# Altium schematic sheet GL852-0.SchDoc
size A4
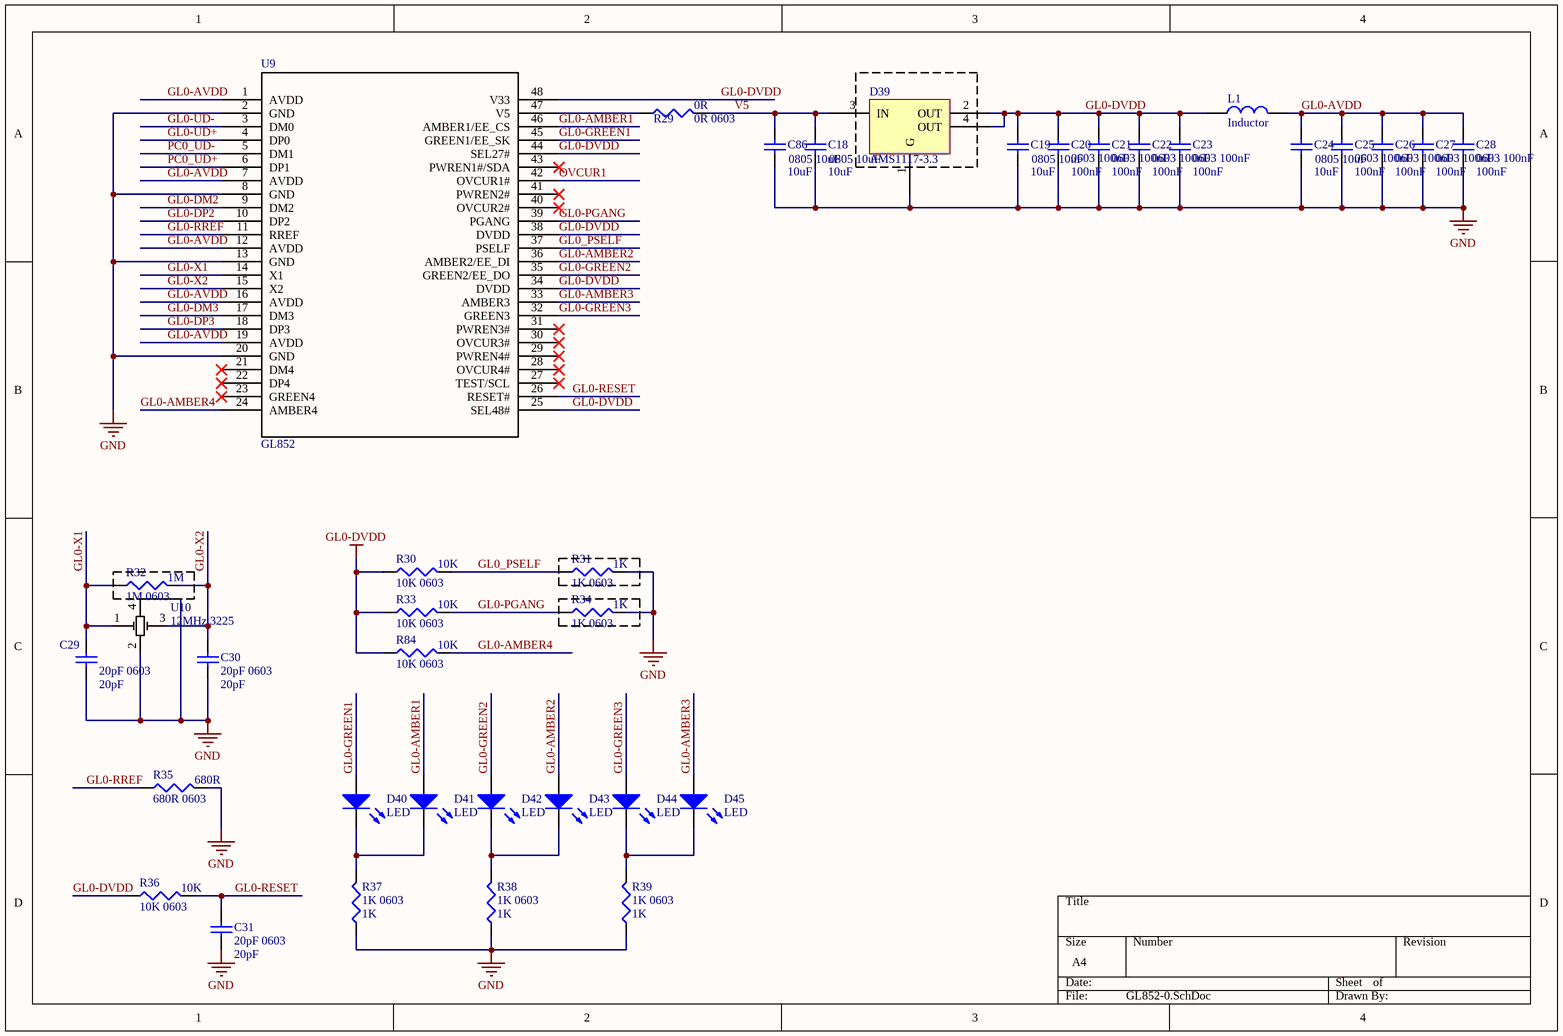
[diagram p0: GL852-0.SchDoc]

## Parts
C18  0805 10uF  value 10uF  [C0805]
C19  0805 10uF  value 10uF  [C0805]
C20  0603 100nF  value 100nF  [C0603]
C21  0603 100nF  value 100nF  [C0603]
C22  0603 100nF  value 100nF  [C0603]
C23  0603 100nF  value 100nF  [C0603]
C24  0805 10uF  value 10uF  [C0805]
C25  0603 100nF  value 100nF  [C0603]
C26  0603 100nF  value 100nF  [C0603]
C27  0603 100nF  value 100nF  [C0603]
C28  0603 100nF  value 100nF  [C0603]
C29  20pF 0603  value 20pF  [C0603]
C30  20pF 0603  value 20pF  [C0603]
C31  20pF 0603  value 20pF  [C0603]
C86  0805 10uF  value 10uF  [C0805]
D39  AMS1117-3.3  [SOT-223]
D40  LED  [LED0603]
D41  LED  [LED0603]
D42  LED  [LED0603]
D43  LED  [LED0603]
D44  LED  [LED0603]
D45  LED  [LED0603]
L1  Inductor  [L0603]
R29  0R 0603  value 0R  [R0603]
R30  10K 0603  value 10K  [R0603]
R31  1K 0603  value 1K  [R0603]
R32  1M 0603  value 1M  [R0603]
R33  10K 0603  value 10K  [R0603]
R34  1K 0603  value 1K  [R0603]
R35  680R 0603  value 680R  [R0603]
R36  10K 0603  value 10K  [R0603]
R37  1K 0603  value 1K  [R0603]
R38  1K 0603  value 1K  [R0603]
R39  1K 0603  value 1K  [R0603]
R84  10K 0603  value 10K  [R0603]
U9  GL852  [qfp48-20-0909b]
U10  12MHz 3225  [XTAL-3225]

## Nets
GL0-DVDD: C19.2 C20.2 C21.2 C22.2 C23.2 D39.2(OUT) D39.4(OUT) L1.1 R30.1 R33.1 R36.1 R84.1 U9.25(SEL48#) U9.34(DVDD) U9.38(DVDD) U9.44(SEL27#) U9.48(V33)
GND: C18.1 C19.1 C20.1 C21.1 C22.1 C23.1 C24.1 C25.1 C26.1 C27.1 C28.1 C29.1 C30.1 C31.1 C86.1 D39.1(G) R31.2 R34.2 R35.2 R37.1 R38.1 R39.1 U9.2(GND) U9.8(GND) U9.13(GND) U9.20(GND) U10.2 U10.4
GL0-AMBER1: D41.1(A) U9.46(AMBER1/EE_CS)
GL0-AMBER2: D43.1(A) U9.36(AMBER2/EE_DI)
GL0-AMBER3: D45.1(A) U9.33(AMBER3)
GL0-AMBER4: R84.2 U9.24(AMBER4)
GL0-AVDD: C24.2 C25.2 C26.2 C27.2 C28.2 L1.2 U9.1(AVDD) U9.7(AVDD) U9.12(AVDD) U9.16(AVDD) U9.19(AVDD)
GL0-DM2: U9.9(DM2)
GL0-DM3: U9.17(DM3)
GL0-DP2: U9.10(DP2)
GL0-DP3: U9.18(DP3)
GL0-GREEN1: D40.1(A) U9.45(GREEN1/EE_SK)
GL0-GREEN2: D42.1(A) U9.35(GREEN2/EE_DO)
GL0-GREEN3: D44.1(A) U9.32(GREEN3)
GL0-PGANG: R33.2 R34.1 U9.39(PGANG)
GL0-RESET: C31.2 R36.2 U9.26(RESET#)
GL0-RREF: R35.1 U9.11(RREF)
GL0-UD+: U9.4(DP0)
GL0-UD-: U9.3(DM0)
GL0-X1: C29.2 R32.1 U9.14(X1) U10.1
GL0-X2: C30.2 R32.2 U9.15(X2) U10.3
GL0_PSELF: R30.2 R31.1 U9.37(PSELF)
OVCUR1: U9.42(OVCUR1#)
PC0_UD+: U9.6(DP1)
PC0_UD-: U9.5(DM1)
V5: C18.2 C86.2 D39.3(IN) R29.2
NetD40_2: D40.2(K) D41.2(K) R37.2
NetD42_2: D42.2(K) D43.2(K) R38.2
NetD44_2: D44.2(K) D45.2(K) R39.2
NetR29_1: R29.1 U9.47(V5)

Not connected (* = marked no-connect by the designer): U9 21(DM4)* 22(DP4)* 23(GREEN4)* 27(TEST/SCL)* 28(OVCUR4#)* 29(PWREN4#)* 30(OVCUR3#)* 31(PWREN3#)* 40(OVCUR2#)* 41(PWREN2#)* 43(PWREN1#/SDA)*

## Library data of the parts
C18-C31 C86 = Cap Semi: Capacitor (Semiconductor SIM Model); Published: 8-Jun-2000; LatestRevisionDate: 29-May-2009; LatestRevisionNote: IPC-7351 Footprint Added.; PackageReference: C1206; Publisher: Altium Limited; PackageDescription: Chip Capacitor
R29-R39 R84 = Res3: Resistor; Published: 8-Jun-2000; LatestRevisionDate: 29-May-2009; LatestRevisionNote: IPC-7351 Footprint Added.; PackageReference: J1-0603; Publisher: Altium Limited; PackageDescription: Chip Resistor
U9 = GL852: Imported; Devide: GL852; RefDes: RefDes; Type: DEV; Value: Value
U10 = Component_1